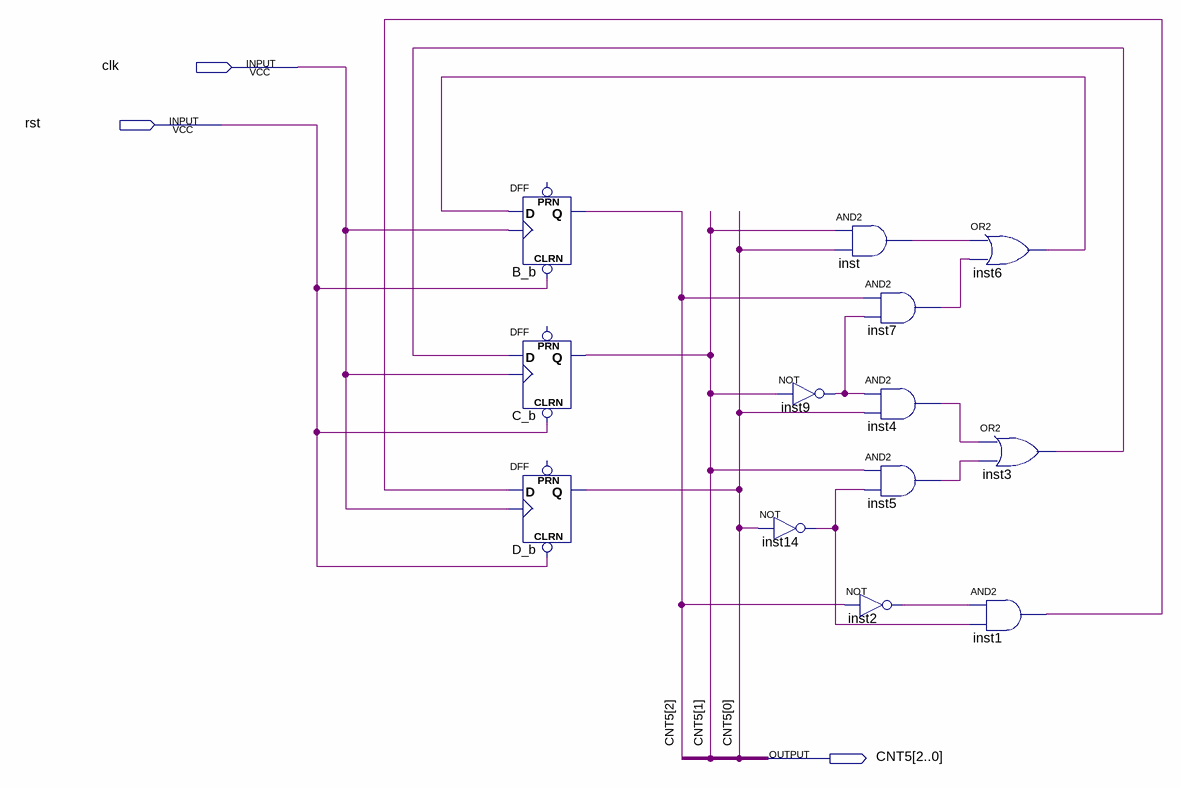
[diagram p0: schematic sheet]
// Quartus schematic countFour.bdf as structural Verilog: 13 symbols, 3 pins
module countFour (
  input  clk,
  input  rst,
  output [2:0] CNT5
);

  wire inst1_out, inst2_out, inst3_out, inst4_out, inst5_out, inst6_out, inst7_out, inst9_out, inst14_out,
       inst_out;

  DFF B_b (.CLRN(rst), .CLK(clk), .D(inst6_out), .Q(CNT5[2]));  // open: PRN
  DFF C_b (.CLRN(rst), .CLK(clk), .D(inst3_out), .Q(CNT5[1]));  // open: PRN
  DFF D_b (.CLRN(rst), .CLK(clk), .D(inst1_out), .Q(CNT5[0]));  // open: PRN
  not inst9 (inst9_out, CNT5[1]);
  not inst14 (inst14_out, CNT5[0]);
  and inst (inst_out, CNT5[1], CNT5[0]);
  not inst2 (inst2_out, CNT5[2]);
  and inst7 (inst7_out, CNT5[2], inst9_out);
  and inst4 (inst4_out, inst9_out, CNT5[0]);
  and inst5 (inst5_out, CNT5[1], inst14_out);
  or inst6 (inst6_out, inst_out, inst7_out);
  or inst3 (inst3_out, inst4_out, inst5_out);
  and inst1 (inst1_out, inst2_out, inst14_out);
endmodule
